# Altium schematic sheet 03_SD_Card.SchDoc
size A; SheetNumber: 4; SheetTotal: 5; SPICEModelCacheQXWVHNIS: <root> / <DocumentId>QXWVHNIS</DocumentId> / <CacheFrame Number="0"> / <Model Name="ewk105c6104_phf" Kind="CKT"> / <Text>* EWK105C6104_PHF     SPICE MODEL  ( General Type ) / *-------------------------------------------------------------------------------------------------------- / * Model Generated by TAIYO YUDEN Corporation (http://www.ty-top.com) / * Version 1.0 / * TAIYO YUDEN Control No. 170508_130520 / * Copyright(c) 2013 TAIYO YUDEN CO.,LTD. All Rights Reserved. / *-------------------------------------------------------------------------------------------------------- / * / * Products Name : Multilayer Ceramic Capacitors / * / * Characteristics : / *     Capacitance : 0.1 uF , Rated Voltage : 16V , TCC : X6S / *     Case Size : 0.52 x 1.0 / 0.02 x 0.039 [mm/inch] , Thickness : 0.3 / 0.012 [mm/inch] / *     (Conditions: Temperature = 25 degC , DC Bias Current/Voltage = 0A / 0V) / * / * Frequency Range : 30000Hz - 3GHz / * / * External Node Assignments : / * / *  1  o---| |---o  2 / * / *-------------------------------------------------------------------------------------------------------- / .SubCkt EWK105C6104_PHF 1 2 / **************************** / C0 1 110 0.093945u / Cm 1 101 4015.5p / C1 101 102 6907.6p / Rc1 101 102 230.37 / C2 102 103 7508.5p / Rc2 102 103 74.952 / C3 103 110 81.048p / Rc3 103 110 59.728 / C2m 1 301 2663.9p / C21 301 302 7378.7p / Rc21 301 302 5.1263k / C22 302 303 0.018069u / Rc22 302 303 1.8135k / C23 303 304 0.013292u / Rc23 303 304 126.5 / C24 304 305 4091.8p / Rc24 304 305 408.26 / C25 305 306 9025.2p / Rc25 305 306 166.82 / C26 306 307 3751.5p / Rc26 306 307 397.75 / C27 307 308 451.87p / Rc27 307 308 20.437 / C28 308 309 331.33p / Rc28 308 309 27.089 / C29 309 110 79.215p / Rc29 309 110 107.24 / Rp0 1 110 5G / L0 110 120 0.043241n / Lm 120 130 0.056635n / L1 120 121 0.54526p / RL1 121 130 0.48173 / L2 120 122 0.071657n / RL2 122 130 0.79137 / L3 120 123 0.12452n / RL3 123 130 1.2778 / CR 120 124 0.014267u / LR 124 125 0.031885n / RR 125 130 0.12021 / CL 130 140 38.272p / LL 130 140 0.039328n / RL 130 140 3.2412 / Rs 140 2 12.566m / **************************** / .ends EWK105C6104_PHF</Text> / </Model> / </CacheFrame> / </root>
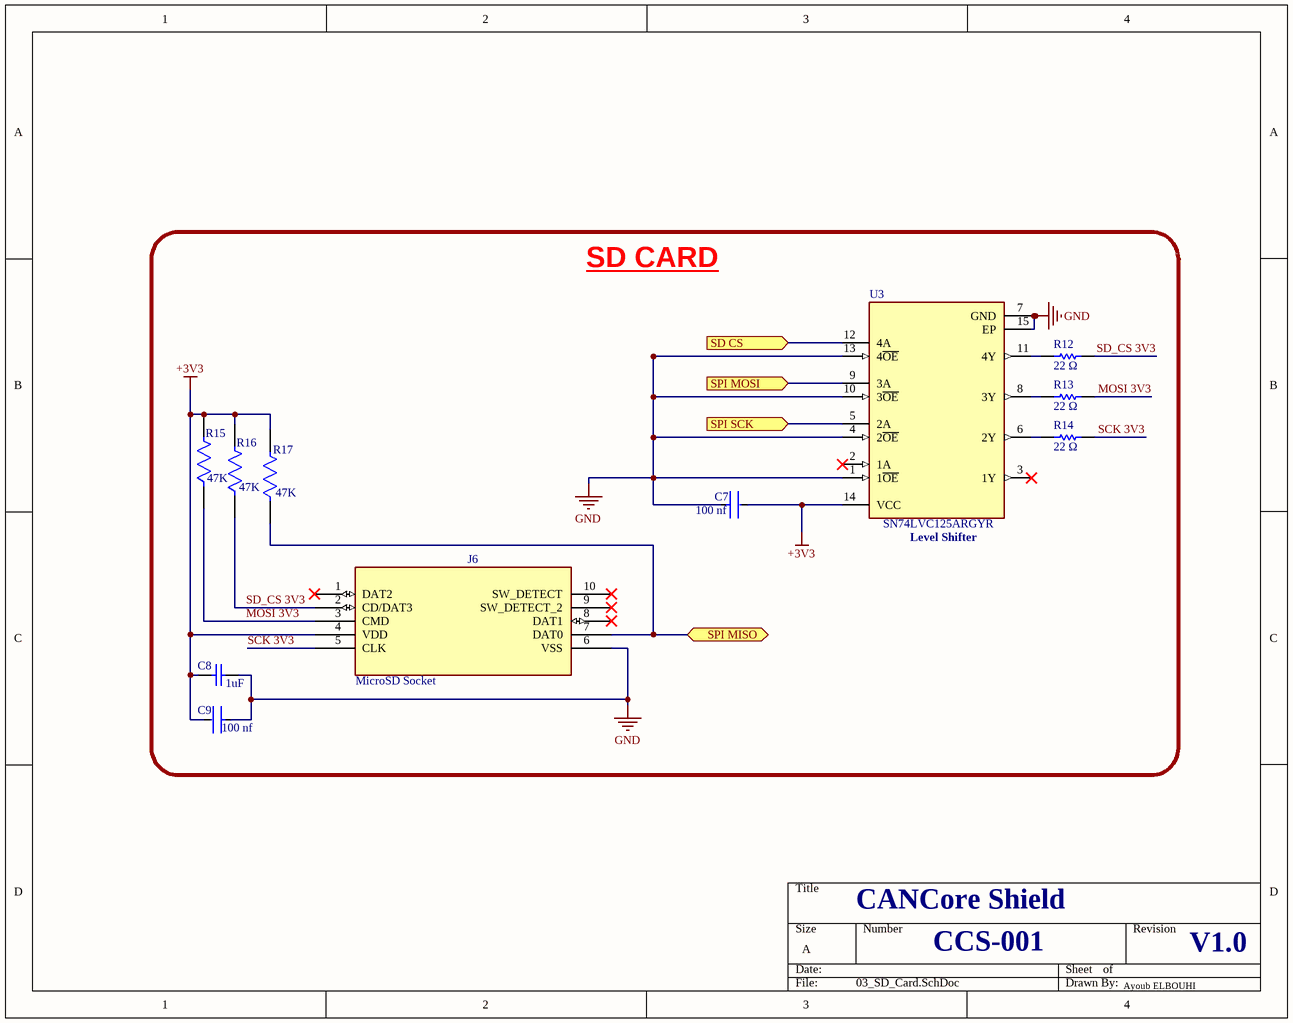
[diagram p0: 03_SD_Card.SchDoc]

## Parts
C7  100 nf  [FP-0204-L_0_52_0_05-W_1_0-IPC_B]
C8  1uF  [CAPC1608X90X35NL10T15]
C9  100 nf  [FP-0204-L_0_52_0_05-W_1_0-IPC_B]
J6  MicroSD Socket  [104031-0811_MOL]
R12  22 Ω  [RESC1608X55X25ML10T15]
R13  22 Ω  [RESC1608X55X25ML10T15]
R14  22 Ω  [RESC1608X55X25ML10T15]
R15  47K  [FP-RC0603FR-0747KL-MFG]
R16  47K  [FP-RC0603FR-0747KL-MFG]
R17  47K  [FP-RC0603FR-0747KL-MFG]
U3  SN74LVC125ARGYR  [FP-RGY0014A-MFG]

## Ports
SD CS (in), SPI MISO (bidir), SPI MOSI (in), SPI SCK (in)

## Nets
+3V3: C7.2 C8.2 C9.2 J6.4(VDD) R15.2 R16.2 R17.2 U3.14(VCC)
GND: C7.1 C8.1 C9.1 J6.6(VSS) U3.1(1~{OE}) U3.4(2~{OE}) U3.7(GND) U3.10(3~{OE}) U3.13(4~{OE}) U3.15(EP)
MOSI 3V3: J6.3(CMD) R13.2 R15.1
SCK 3V3: J6.5(CLK) R14.2
SD CS: U3.12(4A) ; port SD CS
SD_CS 3V3: J6.2(CD/DAT3) R12.2 R16.1
SPI MISO: J6.7(DAT0) R17.1 ; port SPI MISO
SPI MOSI: U3.9(3A) ; port SPI MOSI
SPI SCK: U3.5(2A) ; port SPI SCK
NetR12_1: R12.1 U3.11(4Y)
NetR13_1: R13.1 U3.8(3Y)
NetR14_1: R14.1 U3.6(2Y)

Not connected (* = marked no-connect by the designer): J6 1(DAT2)* 8(DAT1)* 9(SW_DETECT_2)* 10(SW_DETECT)*; U3 2(1A)* 3(1Y)*

## Notes on the sheet
- SD CARD
- (near U3) Level Shifter
- CANCore Shield
- CCS-001
- V1.0
- Ayoub ELBOUHI

## Library data of the parts
C7 C9 = CMP-14477-003485-2: None; Voltage Rating: 16V; Tolerance: 20%; Capacitance: 100nF; Packaging: Tape and Reel; Mount: Surface Mount; Ratings: AEC-Q200; Case/Package: 0204; Case Code (Imperial): 0204; Case Code (Metric): 0610; RoHS Compliant: Yes; Max Operating Temperature: 105°C; Min Operating Temperature: -55°C
C8 = CMP-2006-02831-1: Part Number: GRM188R71A105KA61D; Manufacturer: Murata
J6 = 1040310811: MF: {'manufacturer': u'Molex'}; Package: None; Price: None; Value: *; MP: 1040310811; Availability: Unavailable
R12-R14 = CMP-1659-00033-1: Chip Resistor, 22 Ohm, +/- 1%, 0.1 W, -55 to 155 degC, 0603 (1608 Metric), RoHS, Tape and Reel; Max Ouput Current: 8 A; Case\Package: SIP; Max Input Voltage: 1.4 V; ComponentLink2URL: http://www.yageo.com/documents/recent/PYu-RC_Group_51_RoHS_L_04.pdf; RoHSCompliant: true; Max Operating Temperature: 100 degC; PackageDescription: 2-Pin Surface Mount Device, Body 1.6 x 0.8 mm; ComponentLink1Description: Manufacturer URL; ComponentLink1URL: http://www.yageo.com/; Length: 18.5 mm; REACH SVHC: Unknown; Pins: 4; DatasheetVersion: Rev. 4, 02/2016; PackageReference: 0603; Output Current: 8 A; Min Operating Temperature: -25 degC; Height: 19.6 mm; Mount: Through Hole; Radiation Hardening: No; ComponentLink2Description: Datasheet; Package Quantity: 200; Packaging: Rail/Tube
R15-R17 = CMP-1659-00055-2: RES SMD 47K OHM 1% 1/10W 0603; Voltage Rating: 50V; Temperature Coefficient: 100ppm/°C; Max Power Dissipation: 100mW; Resistance: 47kR; Voltage Rating (DC): 50V; Min Operating Temperature: -55°C; Packaging: Tape and Reel; Features: Moisture Resistant; Termination: SMD/SMT; Technology: THICK FILM; Lead Free: Lead Free; Max Operating Temperature: 155°C; Width: 0.031inch; Case Code (Metric): 1608; Tolerance: 1%; Package Quantity: 1; Resistor Type: Thick Film; RoHS Compliant: Yes; Case/Package: 0603; Case Code (Imperial): 0603; Resistance Tolerance: 1%; Length: 0.063inch; Series: RC; Number of Pins: 2; Power Rating: 100mW; Number of Terminations: 2; Construction: Rectangular; Height: 0.022inch; Military Standard: Not; Size Code: 0603; Depth: 0.8mm
U3 = CMP-0440-00228-5: IC BUF NON-INVERT 3.6V 14VQFN; Number of Input Lines: 4; Number of Bits per Element: 1; Propagation Delay: 4.6ns; High Level Output Current: -24mA; Quiescent Current: 1uA; Max Power Dissipation: 500mW; Turn-On Delay Time: 15.8ns; Number of Output Lines: 3; Logic Function: Buffer; Output Type: 3-STATE; Min Supply Voltage: 1.65V; Low Level Output Current: 24mA; Polarity: Non-Inverting; Technology: CMOS; Mount: Surface Mount; Package Quantity: 3000; Number of Outputs: 4; Number of Circuits: 4; Max Supply Voltage: 3.6V; Max Operating Temperature: 125°C; Number of Inputs: 4; RoHS Compliant: Yes; Number of Pins: 14; Width: 3.65mm; Packaging: Tape and Reel; Min Operating Temperature: -40°C; Length: 3.65mm; Height: 0.95mm; Number of Channels: 4; Number of Elements: 4; Case/Package: VQFN; Radiation Hardening: No; Number of Bits: 4; Lead Free: Lead Free; REACH SVHC: No SVHC; Series: 74LVC